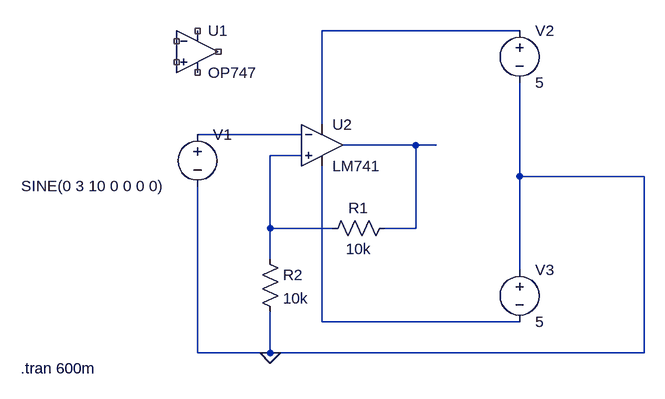
[diagram p0: schematic Vref=0V.asc]
Vref=0V.asc, the LTspice schematic file:
Version 4.1
SHEET 1 880 680
WIRE 464 -32 160 -32
WIRE 160 112 160 -32
WIRE 128 128 -32 128
WIRE 304 144 192 144
WIRE 336 144 304 144
WIRE 128 160 80 160
WIRE 464 192 464 48
WIRE 656 192 464 192
WIRE 80 272 80 160
WIRE 176 272 80 272
WIRE 304 272 304 144
WIRE 304 272 256 272
WIRE 80 320 80 272
WIRE 464 336 464 192
WIRE 160 416 160 176
WIRE 464 416 160 416
WIRE -32 464 -32 208
WIRE 80 464 80 400
WIRE 80 464 -32 464
WIRE 656 464 656 192
WIRE 656 464 80 464
FLAG 80 464 0
SYMBOL OpAmps\\OP747 -32 -64 R0
SYMATTR InstName U1
SYMBOL voltage -32 112 R0
WINDOW 3 -271 95 Left 2
WINDOW 123 0 0 Left 0
WINDOW 39 0 0 Left 0
SYMATTR InstName V1
SYMATTR Value SINE(0 3 10 0 0 0 0)
SYMBOL res 272 256 R90
WINDOW 0 0 56 VBottom 2
WINDOW 3 32 56 VTop 2
SYMATTR InstName R1
SYMATTR Value 10k
SYMBOL res 64 304 R0
SYMATTR InstName R2
SYMATTR Value 10k
SYMBOL voltage 464 -48 R0
WINDOW 123 0 0 Left 0
WINDOW 39 0 0 Left 0
SYMATTR InstName V2
SYMATTR Value 5
SYMBOL voltage 464 320 R0
WINDOW 123 0 0 Left 0
WINDOW 39 0 0 Left 0
SYMATTR InstName V3
SYMATTR Value 5
SYMBOL OpAmps\\LM741 160 80 R0
SYMATTR InstName U2
TEXT -304 488 Left 2 !.tran 600m

The netlist it stands for:
* Vref=0V.asc
X§U1 NC_01 NC_02 NC_03 NC_04 NC_05 OP747  ; pins In+ In- V+ V- OUT
V1 N002 0 SINE(0 3 10 0 0 0 0)
R1 N003 N004 10k
R2 N004 0 10k
V2 N001 0 5
V3 0 N005 5
X§U2 N004 N002 N001 N005 N003 LM741  ; pins In+ In- V+ V- OUT
.tran 600m
.lib LM741.lib
.backanno
.end